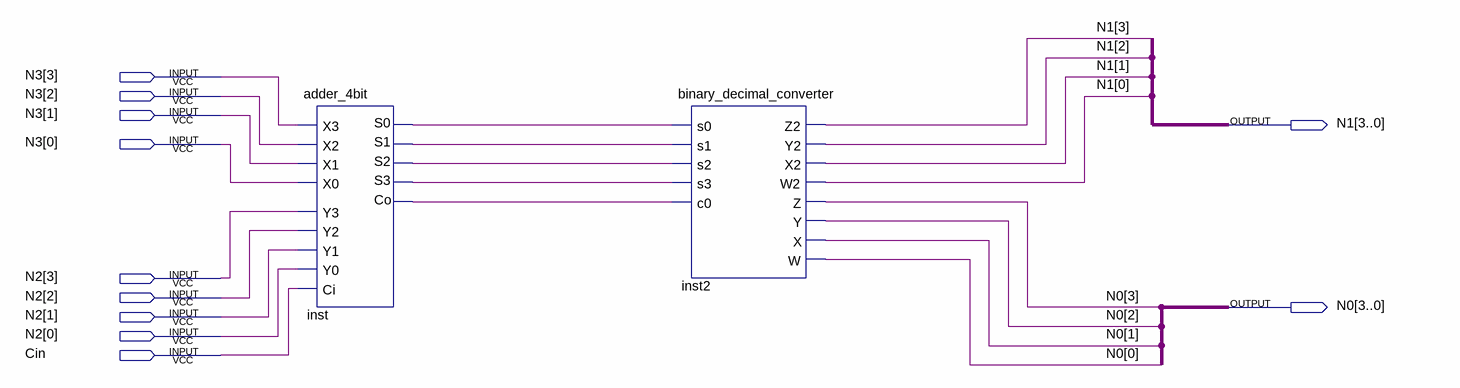
[diagram p0: schematic sheet]
// Quartus schematic lab6step0.bdf as structural Verilog: 2 symbols, 11 pins
module lab6step0 (
  input  [3:0] N3,
  input  [3:0] N2,
  input  Cin,
  output [3:0] N1,
  output [3:0] N0
);

  wire inst_co, inst_s0, inst_s1, inst_s2, inst_s3;

  adder_4bit inst (
    .X3(N3[3]), .Y3(N2[3]), .X2(N3[2]), .Y2(N2[2]), .X1(N3[1]), .Y1(N2[1]), .X0(N3[0]), .Y0(N2[0]), .Ci(Cin),
    .S0(inst_s0), .S1(inst_s1), .S2(inst_s2), .S3(inst_s3), .Co(inst_co));
  binary_decimal_converter inst2 (
    .s0(inst_s0), .s1(inst_s1), .s2(inst_s2), .s3(inst_s3), .c0(inst_co), .Z2(N1[3]), .Y2(N1[2]), .X2(N1[1]),
    .W2(N1[0]), .Z(N0[3]), .Y(N0[2]), .X(N0[1]), .W(N0[0]));
endmodule
